# Altium schematic sheet USB.SchDoc
size A4; Organization: Altium Limited; Address1: L3, 12a Rodborough Rd; Address2: Frenchs Forest; Address3: NSW; Address4: Australia 2086
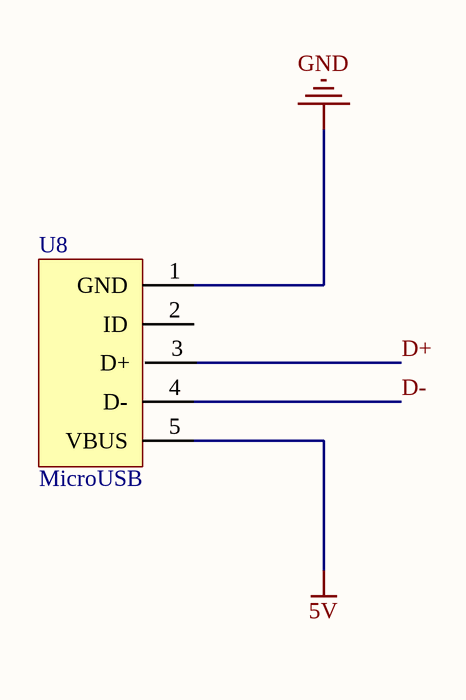
[diagram p0: USB.SchDoc]

## Parts
U8  MicroUSB  [Micro-USB]

## Nets
5V: U8.5(VBUS)
GND: U8.1(GND)
D+: U8.3(D+)
D-: U8.4(D-)

Not connected (* = marked no-connect by the designer): U8 2(ID)

## Notes on the sheet
- Title
- Size:
- Date:
- A4
- Number:
- Time:
- Revision:
- Sheet
- of
- File:

## Library data of the parts
U8 = MicroUSB_B